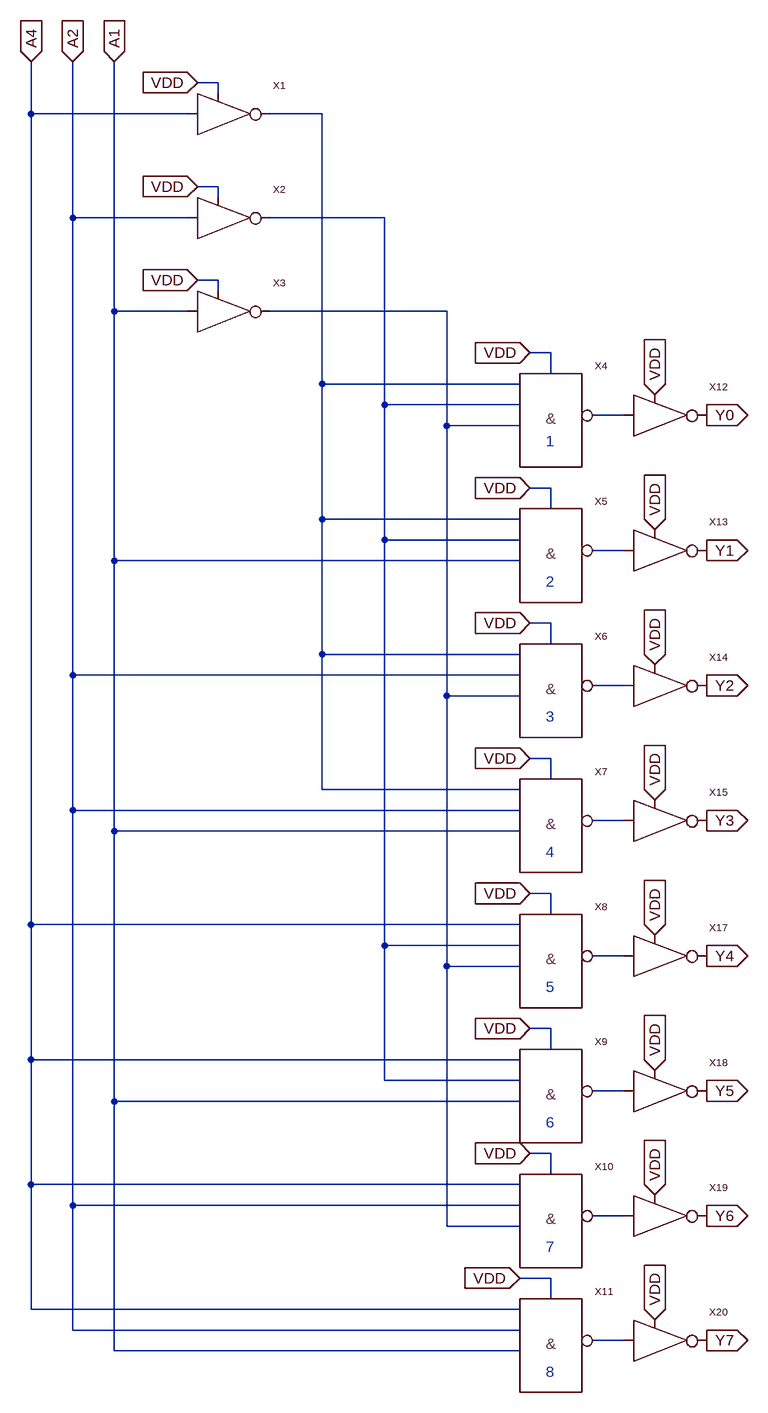
[diagram p0: schematic dc_3_8.asc]
dc_3_8.asc, the LTspice schematic file:
Version 4.1
SHEET 1 1032 1988
WIRE 128 -32 96 -32
WIRE 128 -16 128 -32
WIRE -160 16 -160 -64
WIRE 80 16 -160 16
WIRE 288 16 208 16
WIRE 128 128 96 128
WIRE 128 144 128 128
WIRE -96 176 -96 -64
WIRE 80 176 -96 176
WIRE 384 176 208 176
WIRE 128 272 96 272
WIRE 128 288 128 272
WIRE -32 320 -32 -64
WIRE 80 320 -32 320
WIRE 480 320 208 320
WIRE 640 384 608 384
WIRE 640 416 640 384
WIRE 288 432 288 16
WIRE 592 432 288 432
WIRE 384 464 384 176
WIRE 592 464 384 464
WIRE 752 480 704 480
WIRE 480 496 480 320
WIRE 592 496 480 496
WIRE 640 592 608 592
WIRE 640 624 640 592
WIRE 288 640 288 432
WIRE 592 640 288 640
WIRE 384 672 384 464
WIRE 592 672 384 672
WIRE 752 688 704 688
WIRE -32 704 -32 320
WIRE 592 704 -32 704
WIRE 640 800 608 800
WIRE 640 832 640 800
WIRE 288 848 288 640
WIRE 592 848 288 848
WIRE -96 880 -96 176
WIRE 592 880 -96 880
WIRE 752 896 704 896
WIRE 480 912 480 496
WIRE 592 912 480 912
WIRE 640 1008 608 1008
WIRE 640 1040 640 1008
WIRE 288 1056 288 848
WIRE 592 1056 288 1056
WIRE -96 1088 -96 880
WIRE 592 1088 -96 1088
WIRE 752 1104 704 1104
WIRE -32 1120 -32 704
WIRE 592 1120 -32 1120
WIRE 640 1216 608 1216
WIRE 640 1248 640 1216
WIRE -160 1264 -160 16
WIRE 592 1264 -160 1264
WIRE 384 1296 384 672
WIRE 592 1296 384 1296
WIRE 752 1312 704 1312
WIRE 480 1328 480 912
WIRE 592 1328 480 1328
WIRE 640 1424 608 1424
WIRE 640 1456 640 1424
WIRE -160 1472 -160 1264
WIRE 592 1472 -160 1472
WIRE 384 1504 384 1296
WIRE 592 1504 384 1504
WIRE 752 1520 704 1520
WIRE -32 1536 -32 1120
WIRE 592 1536 -32 1536
WIRE 640 1616 608 1616
WIRE 640 1648 640 1616
WIRE -160 1664 -160 1472
WIRE 592 1664 -160 1664
WIRE -96 1696 -96 1088
WIRE 592 1696 -96 1696
WIRE 752 1712 704 1712
WIRE 480 1728 480 1328
WIRE 592 1728 480 1728
WIRE 640 1808 592 1808
WIRE 640 1840 640 1808
WIRE -160 1856 -160 1664
WIRE 592 1856 -160 1856
WIRE -96 1888 -96 1696
WIRE 592 1888 -96 1888
WIRE 752 1904 704 1904
WIRE -32 1920 -32 1536
WIRE 592 1920 -32 1920
FLAG -32 -64 A1
IOPIN -32 -64 In
FLAG -96 -64 A2
IOPIN -96 -64 In
FLAG -160 -64 A4
IOPIN -160 -64 In
FLAG 592 1808 VDD
IOPIN 592 1808 In
FLAG 96 -32 VDD
IOPIN 96 -32 In
FLAG 96 128 VDD
IOPIN 96 128 In
FLAG 96 272 VDD
IOPIN 96 272 In
FLAG 880 480 Y0
IOPIN 880 480 Out
FLAG 880 688 Y1
IOPIN 880 688 Out
FLAG 880 896 Y2
IOPIN 880 896 Out
FLAG 880 1104 Y3
IOPIN 880 1104 Out
FLAG 880 1312 Y4
IOPIN 880 1312 Out
FLAG 880 1520 Y5
IOPIN 880 1520 Out
FLAG 880 1712 Y6
IOPIN 880 1712 Out
FLAG 880 1904 Y7
IOPIN 880 1904 Out
FLAG 608 592 VDD
IOPIN 608 592 In
FLAG 608 384 VDD
IOPIN 608 384 In
FLAG 608 800 VDD
IOPIN 608 800 In
FLAG 608 1008 VDD
IOPIN 608 1008 In
FLAG 608 1216 VDD
IOPIN 608 1216 In
FLAG 608 1424 VDD
IOPIN 608 1424 In
FLAG 608 1616 VDD
IOPIN 608 1616 In
FLAG 800 448 VDD
IOPIN 800 448 In
FLAG 800 656 VDD
IOPIN 800 656 In
FLAG 800 864 VDD
IOPIN 800 864 In
FLAG 800 1072 VDD
IOPIN 800 1072 In
FLAG 800 1280 VDD
IOPIN 800 1280 In
FLAG 800 1488 VDD
IOPIN 800 1488 In
FLAG 800 1680 VDD
IOPIN 800 1680 In
FLAG 800 1872 VDD
IOPIN 800 1872 In
SYMBOL inverter_nand2 144 16 R0
SYMATTR InstName X1
SYMBOL inverter_nand2 144 176 R0
SYMATTR InstName X2
SYMBOL inverter_nand2 144 320 R0
SYMATTR InstName X3
SYMBOL nand3 640 480 R0
SYMATTR InstName X4
SYMBOL nand3 640 688 R0
SYMATTR InstName X5
SYMBOL nand3 640 896 R0
SYMATTR InstName X6
SYMBOL nand3 640 1104 R0
SYMATTR InstName X7
SYMBOL nand3 640 1312 R0
SYMATTR InstName X8
SYMBOL nand3 640 1520 R0
SYMATTR InstName X9
SYMBOL nand3 640 1712 R0
SYMATTR InstName X10
SYMBOL nand3 640 1904 R0
SYMATTR InstName X11
SYMBOL inverter_nand2 816 480 R0
SYMATTR InstName X12
SYMBOL inverter_nand2 816 688 R0
SYMATTR InstName X13
SYMBOL inverter_nand2 816 896 R0
SYMATTR InstName X14
SYMBOL inverter_nand2 816 1104 R0
SYMATTR InstName X15
SYMBOL inverter_nand2 816 1312 R0
SYMATTR InstName X17
SYMBOL inverter_nand2 816 1520 R0
SYMATTR InstName X18
SYMBOL inverter_nand2 816 1712 R0
SYMATTR InstName X19
SYMBOL inverter_nand2 816 1904 R0
SYMATTR InstName X20
TEXT 632 520 Left 2 ;1
TEXT 632 736 Left 2 ;2
TEXT 632 944 Left 2 ;3
TEXT 632 1152 Left 2 ;4
TEXT 632 1360 Left 2 ;5
TEXT 632 1568 Left 2 ;6
TEXT 632 1760 Left 2 ;7
TEXT 632 1952 Left 2 ;8

The netlist it stands for:
* dc_3_8.asc
X§X1 A4 N001 VDD inverter_nand2  ; pins VIN VOUT VDD
X§X2 A2 N002 VDD inverter_nand2  ; pins VIN VOUT VDD
X§X3 A1 N003 VDD inverter_nand2  ; pins VIN VOUT VDD
X§X4 N001 N002 N003 VDD N004 nand3  ; pins A B C VDD Y
X§X5 N001 N002 A1 VDD N005 nand3  ; pins A B C VDD Y
X§X6 N001 A2 N003 VDD N006 nand3  ; pins A B C VDD Y
X§X7 N001 A2 A1 VDD N007 nand3  ; pins A B C VDD Y
X§X8 A4 N002 N003 VDD N008 nand3  ; pins A B C VDD Y
X§X9 A4 N002 A1 VDD N009 nand3  ; pins A B C VDD Y
X§X10 A4 A2 N003 VDD N010 nand3  ; pins A B C VDD Y
X§X11 A4 A2 A1 VDD N011 nand3  ; pins A B C VDD Y
X§X12 N004 Y0 VDD inverter_nand2  ; pins VIN VOUT VDD
X§X13 N005 Y1 VDD inverter_nand2  ; pins VIN VOUT VDD
X§X14 N006 Y2 VDD inverter_nand2  ; pins VIN VOUT VDD
X§X15 N007 Y3 VDD inverter_nand2  ; pins VIN VOUT VDD
X§X17 N008 Y4 VDD inverter_nand2  ; pins VIN VOUT VDD
X§X18 N009 Y5 VDD inverter_nand2  ; pins VIN VOUT VDD
X§X19 N010 Y6 VDD inverter_nand2  ; pins VIN VOUT VDD
X§X20 N011 Y7 VDD inverter_nand2  ; pins VIN VOUT VDD
* 1
* 2
* 3
* 4
* 5
* 6
* 7
* 8
.backanno
.end